# EasyEDA Pro project ProPrj_MPY634乘法器_2025-07-24.epro

# Schematic Schematic1
Board Name: Board1; Create Date: 2025-07-24; Page Name: P1; Project Name: MPY634乘法器; Schematic Name: Schematic1; Update Date: 2025-07-24; Company: 嘉立创EDA; Page Size: A4; Version: V1.0
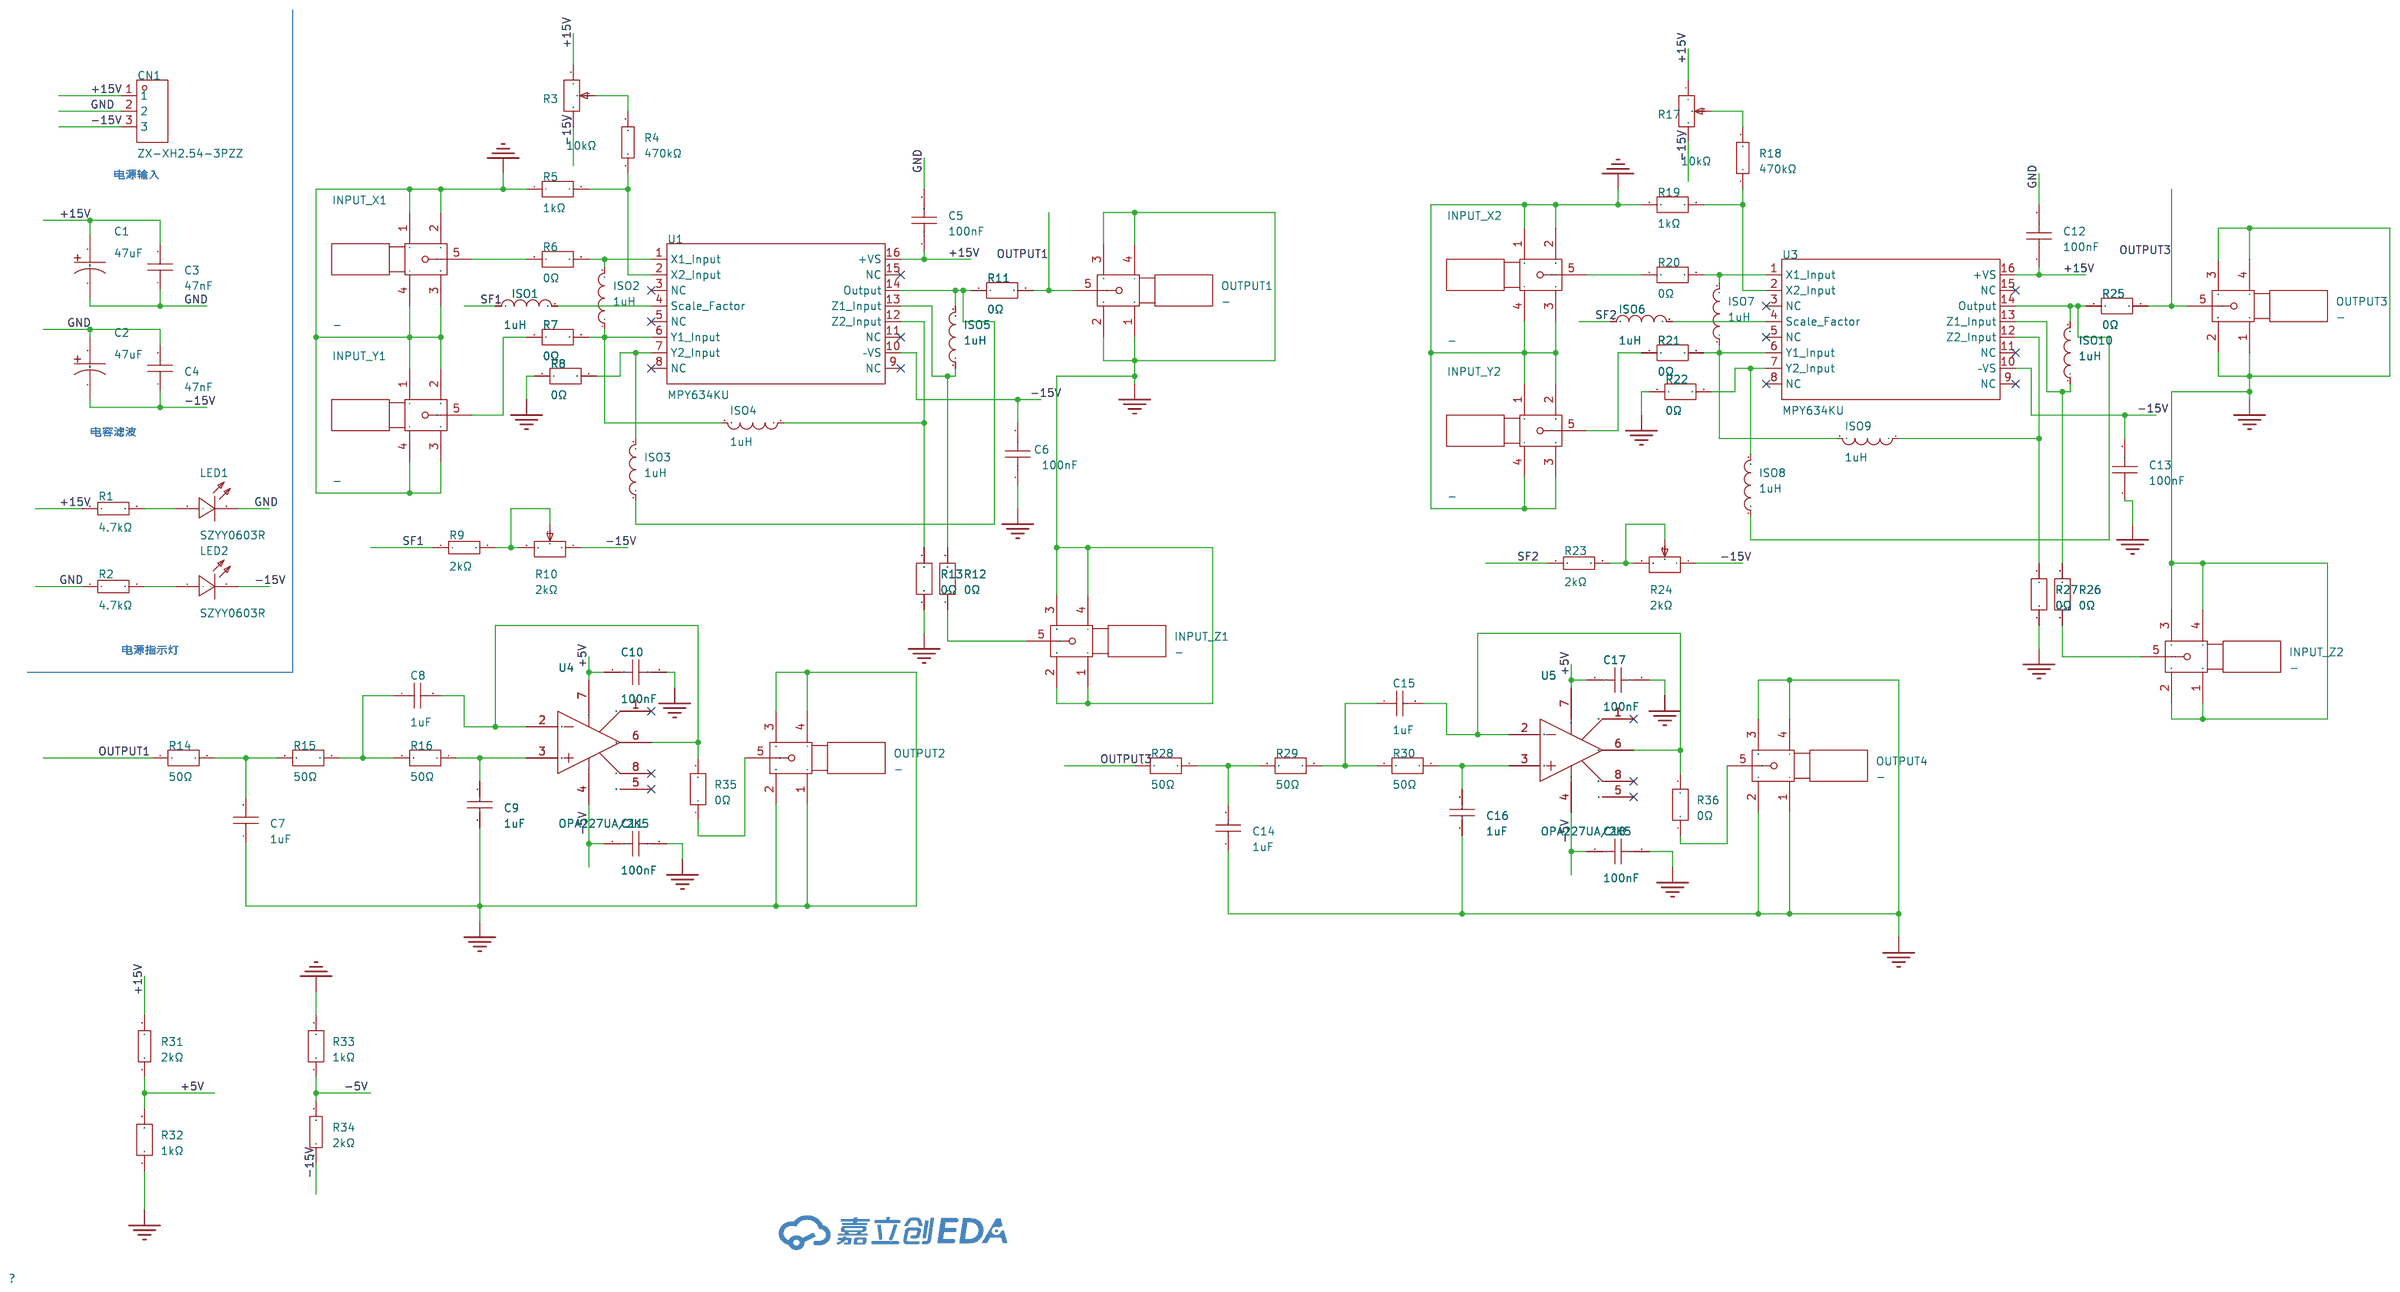
[diagram p0: schematic sheet]

## Parts
C1  47uF  [CAP-TH_BD5.0-P2.00-D0.8-FD]
C2  47uF  [CAP-TH_BD5.0-P2.00-D0.8-FD]
C3  47nF  [C0805]
C4  47nF  [C0805]
C5  100nF  [C0805]
C6  100nF  [C0805]
C7  1uF  [C0805]
C8  1uF  [C0805]
C9  1uF  [C0805]
C10  100nF  [C0805]
C11  100nF  [C0805]
C12  100nF  [C0805]
C13  100nF  [C0805]
C14  1uF  [C0805]
C15  1uF  [C0805]
C16  1uF  [C0805]
C17  100nF  [C0805]
C18  100nF  [C0805]
CN1  ZX-XH2.54-3PZZ  [CONN-TH_3P-P2.54_2501S-3P]
INPUT_X1  -  [SMA-SMD_BWSMA-KE-P001]
INPUT_X2  -  [SMA-SMD_BWSMA-KE-P001]
INPUT_Y1  -  [SMA-SMD_BWSMA-KE-P001]
INPUT_Y2  -  [SMA-SMD_BWSMA-KE-P001]
INPUT_Z1  -  [SMA-SMD_BWSMA-KE-P001]
INPUT_Z2  -  [SMA-SMD_BWSMA-KE-P001]
ISO1  1uH  [IND-SMD_L1.0-W0.6]
ISO2  1uH  [IND-SMD_L1.0-W0.6]
ISO3  1uH  [IND-SMD_L1.0-W0.6]
ISO4  1uH  [IND-SMD_L1.0-W0.6]
ISO5  1uH  [IND-SMD_L1.0-W0.6]
ISO6  1uH  [IND-SMD_L1.0-W0.6]
ISO7  1uH  [IND-SMD_L1.0-W0.6]
ISO8  1uH  [IND-SMD_L1.0-W0.6]
ISO9  1uH  [IND-SMD_L1.0-W0.6]
ISO10  1uH  [IND-SMD_L1.0-W0.6]
LED1  SZYY0603R  [LED0603-R-RD]
LED2  SZYY0603R  [LED0603-R-RD]
OUTPUT1  -  [SMA-SMD_BWSMA-KE-P001]
OUTPUT2  -  [SMA-SMD_BWSMA-KE-P001]
OUTPUT3  -  [SMA-SMD_BWSMA-KE-P001]
OUTPUT4  -  [SMA-SMD_BWSMA-KE-P001]
R1  4.7kΩ  [R0805]
R2  4.7kΩ  [R0805]
R3  10kΩ  [RES-ADJ-TH_3296W]
R4  470kΩ  [R0805]
R5  1kΩ  [R0805]
R6  0Ω  [R0603]
R7  0Ω  [R0603]
R8  0Ω  [R0603]
R9  2kΩ  [R0805]
R10  2kΩ  [RES-ADJ-TH_3296W]
R11  0Ω  [R0603]
R12  0Ω  [R0603]
R13  0Ω  [R0603]
R14  50Ω  [R0805]
R15  50Ω  [R0805]
R16  50Ω  [R0805]
R17  10kΩ  [RES-ADJ-TH_3296W]
R18  470kΩ  [R0805]
R19  1kΩ  [R0805]
R20  0Ω  [R0603]
R21  0Ω  [R0603]
R22  0Ω  [R0603]
R23  2kΩ  [R0805]
R24  2kΩ  [RES-ADJ-TH_3296W]
R25  0Ω  [R0603]
R26  0Ω  [R0603]
R27  0Ω  [R0603]
R28  50Ω  [R0805]
R29  50Ω  [R0805]
R30  50Ω  [R0805]
R31  2kΩ  [R0805]
R32  1kΩ  [R0805]
R33  1kΩ  [R0805]
R34  2kΩ  [R0805]
R35  0Ω  [R0603]
R36  0Ω  [R0603]
U1  MPY634KU  [SOIC-16_L10.3-W7.5-P1.27-LS10.3-BL]
U3  MPY634KU  [SOIC-16_L10.3-W7.5-P1.27-LS10.3-BL]
U4  OPA227UA/2K5  [SOIC-8_L4.9-W3.9-P1.27-LS6.0-BL]
U5  OPA227UA/2K5  [SOIC-8_L4.9-W3.9-P1.27-LS6.0-BL]

## Library data of the parts
C1 C2 = NXB25V47M5*11 2.5TP: 容值:47uF;精度:±20%;额定电压:25V;纹波电流:250mA@100kHz;等效串联电阻(ESR):300mΩ@100kHz;; LCSC Part Name: 47uF ±20% 25V; Supplier Part: C371230; Manufacturer: SAMYOUNG(韩国三莹); Supplier Footprint: 插件,D5xL11mm; JLCPCB Part Class: 扩展库; Datasheet: https://atta.szlcsc.com/upload/public/pdf/source/20190227/C371244_FA85FFEFC2961227CF12E3CCE8C34A7D.pdf; Supplier: LCSC; Tolerance: ±20%; Voltage Rating: 25V; Ripple Current: 250mA@100kHz; Equivalent Series Resistance(ESR): 300mΩ@100kHz; Pin Spacing: 2mm; Diameter: 5mm; Height - Seated (Max): 11mm; Lifetime: 2000hrs@105℃; Operating Temperature: -40℃~+105℃
C3 C4 = CL21B473KBCNNNC: 容值:47nF;精度:±10%;额定电压:50V;材质(温度系数):X7R;; LCSC Part Name: 47nF ±10% 50V; Supplier Part: C53134; Manufacturer: SAMSUNG(三星); Supplier Footprint: 0805; JLCPCB Part Class: 基础库; Datasheet: https://atta.szlcsc.com/upload/public/pdf/source/20160218/1457707763339.pdf; Supplier: LCSC; Tolerance: ±10%; Voltage Rated: 50V; Temperature Coefficient: X7R
C5 C6 C10-C13 C17 C18 = CC0805KRX7R9BB104: 容值:100nF;精度:±10%;额定电压:50V;材质(温度系数):X7R;; LCSC Part Name: 100nF ±10% 50V; Supplier Part: C49678; Manufacturer: YAGEO(国巨); Supplier Footprint: 0805; JLCPCB Part Class: 基础库; Datasheet: https://atta.szlcsc.com/upload/public/pdf/source/20180224/C181747_15194369449651363981.pdf; Supplier: LCSC; Tolerance: ±10%; Voltage Rated: 50V; Temperature Coefficient: X7R
C7-C9 C14-C16 = CL21B105KBFNNNE: 容值:1uF;精度:±10%;额定电压:50V;材质(温度系数):X7R;; LCSC Part Name: 1uF ±10% 50V; Supplier Part: C28323; Manufacturer: SAMSUNG(三星); Supplier Footprint: 0805; JLCPCB Part Class: 基础库; Datasheet: https://atta.szlcsc.com/upload/public/pdf/source/20160218/1457707763339.pdf; Supplier: LCSC; Tolerance: ±10%; Voltage Rated: 50V; Temperature Coefficient: X7R
CN1 = ZX-XH2.54-3PZZ: 插针结构:1x3P;间距:2.5mm;安装方式:直插;参考系列:XH;总PIN数:3P;排数:1;每排PIN数:3;行距:-;额定电流:3A;触头材质:黄铜;触头镀层:锡;工作温度范围:-25℃~+85℃;; LCSC Part Name: 1x3P 间距:2.5mm 直插 系列:XH; Supplier Part: C7429633; Manufacturer: Megastar(兆星); Supplier Footprint: 插件,P=2.5mm; JLCPCB Part Class: 扩展库; Datasheet: https://atta.szlcsc.com/upload/public/pdf/source/20230619/AE17037A2CFDBE8D9CBA775D61AD0A84.pdf; Supplier: LCSC; Pins Structure: 1x3P; Pitch: 2.5mm; Mounting Type: 直插; Reference Series: XH; Number of Pins: 3P; Number of Rows: 1; Number of PINs Per Row: 3; Rated Current: 3A; Contact Material: 黄铜; Contact Plating: 锡; Operating Temperature: -25℃~+85℃; Rated Voltage (Max): 250V; Plastic Material: PA66; Flame Retardant Rating: UL94V-0; Color: 白色; Z-Height of the Board: 7mm; X-Length of Bottom Edge on Board (Spacing Line): 10mm; Y-Width of Bottom Edge on Board: 5.9mm
INPUT_X1 INPUT_X2 INPUT_Y1 INPUT_Y2 INPUT_Z1 INPUT_Z2 OUTPUT1-OUTPUT4 = BWSMA-KE-P001: 连接器类型:板端;接口类型:内孔;端口数量:1;接口直径:5.2mm;接口长度/高度:-;频率:-;射频系列:SMA;阻抗:50Ω;样式:偏脚;工作温度:-;; LCSC Part Name: 内孔 SMA 偏脚; Supplier Part: C496550; Manufacturer: BAT WIRELESS(蝙蝠无线); Supplier Footprint: SMD; JLCPCB Part Class: 扩展库; Datasheet: https://atta.szlcsc.com/upload/public/pdf/source/20240320/28FD502871C976DFF213ABFCF2A0ED51.pdf; Supplier: LCSC; Connector Type: 板端; Interface: 内孔; Number of Ports: 1; Interface Diameter: 5.2mm; RF Series: SMA; Impedance: 50Ω; Style: 偏脚
ISO1-ISO10 = LQW15CN1R0M10D: 电感值:1uH;精度:±20%;额定电流:270mA;饱和电流(Isat):-;; LCSC Part Name: 1uH ±20%; Supplier Part: C703068; Manufacturer: muRata(村田); Supplier Footprint: 0402; JLCPCB Part Class: 扩展库; Datasheet: https://atta.szlcsc.com/upload/public/pdf/source/20191022/C440248_094C93E028FCF0FA66FA57BC1ADCD3EF.pdf; Supplier: LCSC; Tolerance: ±20%; Rated Current: 270mA; DC Resistance (DCR): 940mΩ
LED1 LED2 = SZYY0603R: 发光颜色:红色;功率:40mW;正向电流:20mA;主波长:615nm~630nm;二极管配置:-;透镜颜色:无色透明透镜;色温:-;发光角度:120°;载带方式:-;工作温度:-40℃~+85℃;; LCSC Part Name: 红灯; Supplier Part: C434419; Manufacturer: yongyu(永裕光电); Supplier Footprint: 0603; JLCPCB Part Class: 扩展库; Datasheet: https://atta.szlcsc.com/upload/public/pdf/source/20191204/C434419_0B955C1F73FF88449D9A795B6FF49070.pdf; Supplier: LCSC; Emitted Color: 红色; Power Dissipation: 40mW; Forward Current: 20mA; Dominant Wavelength: 615nm~630nm; Peak Wavelength: 645nm; Lens Color: 无色透明透镜; Viewing Angle: 120°; Operating Temperature: -40℃~+85℃
R1 R2 = 0805W8F4701T5E: 电阻类型:厚膜电阻;阻值:4.7kΩ;精度:±1%;功率:125mW;最大工作电压:150V;温度系数:±100ppm/℃;; LCSC Part Name: 4.7kΩ ±1% 125mW 厚膜电阻; Supplier Part: C17673; Manufacturer: UNI-ROYAL(厚声); Supplier Footprint: 0805; JLCPCB Part Class: 基础库; Datasheet: https://atta.szlcsc.com/upload/public/pdf/source/20200306/C422600_1E6D84923E4A46A82E41ADD87F860B5C.pdf; Supplier: LCSC; Type: 厚膜电阻; Tolerance: ±1%; Power(Watts): 125mW; Overload Voltage (Max): 150V; Temperature Coefficient: ±100ppm/℃; Operating Temperature Range: -55℃~+155℃
R3 R17 = 3296W-1-103LF: 阻值:10kΩ;精度:±10%;功率:500mW;温度系数:±100ppm/℃;; LCSC Part Name: 10kΩ ±10%; Supplier Part: C34846; Manufacturer: BOURNS; Supplier Footprint: SIP-3P,9.5x4.8mm; JLCPCB Part Class: 扩展库; Datasheet: https://atta.szlcsc.com/upload/public/pdf/source/20151026/1457707506403.pdf; Supplier: LCSC; Tolerance: ±10%; Power(Watts): 500mW; Temperature Coefficient: ±100ppm/℃; Turns: 25
R4 R18 = 0805W8F4703T5E: 电阻类型:厚膜电阻;阻值:470kΩ;精度:±1%;功率:125mW;最大工作电压:150V;温度系数:±100ppm/℃;; LCSC Part Name: 470kΩ ±1% 125mW 厚膜电阻; Supplier Part: C17709; Manufacturer: UNI-ROYAL(厚声); Supplier Footprint: 0805; JLCPCB Part Class: 基础库; Datasheet: https://atta.szlcsc.com/upload/public/pdf/source/20200306/C422600_1E6D84923E4A46A82E41ADD87F860B5C.pdf; Supplier: LCSC; Type: 厚膜电阻; Tolerance: ±1%; Power(Watts): 125mW; Overload Voltage (Max): 150V; Temperature Coefficient: ±100ppm/℃; Operating Temperature Range: -55℃~+155℃
R5 R19 R32 R33 = FRC0805J102 TS: 电阻类型:厚膜电阻;阻值:1kΩ;精度:±5%;功率:125mW;最大工作电压:150V;温度系数:±100ppm/℃;; LCSC Part Name: 1kΩ ±5% 125mW 厚膜电阻; Supplier Part: C2907295; Manufacturer: FOJAN(富捷); Supplier Footprint: 0805; JLCPCB Part Class: 扩展库; Datasheet: https://atta.szlcsc.com/upload/public/pdf/source/20211221/925EC7D7225764EE0046F22065062C87.pdf; Supplier: LCSC; Type: 厚膜电阻; Tolerance: ±5%; Power(Watts): 125mW; Overload Voltage (Max): 150V; Temperature Coefficient: ±100ppm/℃; Operating Temperature Range: -55℃~+155℃
R6-R8 R11-R13 R20-R22 R25-R27 R35 R36 = FRC0603P000 TS: 电阻类型:厚膜电阻;阻值:0Ω;精度:±5%;功率:100mW;最大工作电压:75V;; LCSC Part Name: 0Ω ±5% 100mW 厚膜电阻; Supplier Part: C2907080; Manufacturer: FOJAN(富捷); Supplier Footprint: 0603; JLCPCB Part Class: 扩展库; Datasheet: https://atta.szlcsc.com/upload/public/pdf/source/20211221/925EC7D7225764EE0046F22065062C87.pdf; Supplier: LCSC; Type: 厚膜电阻; Tolerance: ±5%; Power(Watts): 100mW; Overload Voltage (Max): 75V; Operating Temperature Range: -55℃~+155℃
R9 R23 R31 R34 = 0805W8F2001T5E: 电阻类型:厚膜电阻;阻值:2kΩ;精度:±1%;功率:125mW;最大工作电压:150V;温度系数:±100ppm/℃;; LCSC Part Name: 2kΩ ±1% 125mW 厚膜电阻; Supplier Part: C17604; Manufacturer: UNI-ROYAL(厚声); Supplier Footprint: 0805; JLCPCB Part Class: 基础库; Datasheet: https://atta.szlcsc.com/upload/public/pdf/source/20200306/C422600_1E6D84923E4A46A82E41ADD87F860B5C.pdf; Supplier: LCSC; Type: 厚膜电阻; Tolerance: ±1%; Power(Watts): 125mW; Overload Voltage (Max): 150V; Temperature Coefficient: ±100ppm/℃; Operating Temperature Range: -55℃~+155℃
R10 R24 = 3296W-1-202LF: 阻值:2kΩ;精度:±10%;; LCSC Part Name: 2kΩ ±10%; Supplier Part: C83684; Manufacturer: BOURNS; Supplier Footprint: SIP-3P,9.5x4.8mm; JLCPCB Part Class: 扩展库; Datasheet: https://atta.szlcsc.com/upload/public/pdf/source/20180326/C111793_7BE3639881F18EA7BF3D269EDA80A489.pdf; Supplier: LCSC; Tolerance: ±10%
R14-R16 R28-R30 = TD05G50R0BT: 电阻类型:薄膜电阻;阻值:50Ω;精度:±0.1%;功率:100mW;温度系数:±25ppm/℃;; LCSC Part Name: 薄膜电阻 50Ω ±0.1% 100mW; Supplier Part: C5355206; Manufacturer: FH(风华); Supplier Footprint: 0805; JLCPCB Part Class: 扩展库; Datasheet: https://atta.szlcsc.com/upload/public/pdf/source/20220726/97950D08E3EA8CC4F1F63A0C564F66E4.pdf; Supplier: LCSC; Type: 薄膜电阻; Tolerance: ±0.1%; Power(Watts): 100mW; Temperature Coefficient: ±25ppm/℃
U1 U3 = MPY634KU: 象限:四象限;带宽:-;; Supplier Part: C2867515; Manufacturer: TI(德州仪器); Supplier Footprint: SOIC-16-300mil; JLCPCB Part Class: 扩展库; Datasheet: https://www.ti.com/cn/lit/gpn/mpy634; Supplier: LCSC; Quadrant: 四象限
U4 U5 = OPA227UA/2K5: 放大器数:单路;增益带宽积(GBP):8MHz;输入偏置电流(Ib):2.5nA;压摆率(SR):2.3V/us;轨到轨:-;; Supplier Part: C456278; Manufacturer: TI(德州仪器); Supplier Footprint: SOIC-8; JLCPCB Part Class: 扩展库; Datasheet: https://www.ti.com/cn/lit/gpn/opa227; Supplier: LCSC; Number of Channels: 单路; Gain Bandwidth Product: 8MHz; Ib - Input Bias Current: 2.5nA; Slew Rate: 2.3V/us; Output Current: 45mA; Operating Temperature: -40℃~+85℃

## Nets
+5V: C10.1 C17.1 R31.1 R32.2 U4.7(VCC) U5.7(VCC)
+15V: C1.1 C3.2 C5.1 C12.1 CN1.1 R1.1 R3.1 R17.1 R31.2 U1.16(+VS) U3.16(+VS)
-5V: C11.1 C18.1 R33.1 R34.2 U4.4(VSS) U5.4(VSS)
-15V: C2.2 C4.1 C6.2 C13.2 CN1.3 LED2.2(-) R3.3 R10.1 R17.3 R24.1 R34.1 U1.10(–VS) U3.10(–VS)
GND: C1.2 C2.1 C3.1 C4.2 C5.2 C6.1 C7.1 C9.1 C10.2 C11.2 C12.2 C13.1 C14.1 C16.1 C17.2 C18.2 CN1.2 INPUT_X1.1 INPUT_X1.2 INPUT_X1.3 INPUT_X1.4 INPUT_X2.1 INPUT_X2.2 INPUT_X2.3 INPUT_X2.4 INPUT_Y1.1 INPUT_Y1.2 INPUT_Y1.3 INPUT_Y1.4 INPUT_Y2.1 INPUT_Y2.2 INPUT_Y2.3 INPUT_Y2.4 INPUT_Z1.1 INPUT_Z1.2 INPUT_Z1.3 INPUT_Z1.4 INPUT_Z2.1 INPUT_Z2.2 INPUT_Z2.3 INPUT_Z2.4 LED1.2(-) OUTPUT1.1 OUTPUT1.2 OUTPUT1.3 OUTPUT1.4 OUTPUT2.1 OUTPUT2.2 OUTPUT2.3 OUTPUT2.4 OUTPUT3.1 OUTPUT3.2 OUTPUT3.3 OUTPUT3.4 OUTPUT4.1 OUTPUT4.2 OUTPUT4.3 OUTPUT4.4 R2.1 R5.1 R8.1 R13.2 R19.1 R22.1 R27.2 R32.1 R33.2
OUTPUT1: OUTPUT1.5 R11.2 R14.1
OUTPUT3: OUTPUT3.5 R25.2 R28.1
SF1: ISO1.1 R9.1
SF2: ISO6.1 R23.1
$1N691: LED2.1(+) R2.2
$1N692: LED1.1(+) R1.2
$1N1030: INPUT_X1.5 R6.1
$1N1329: R3.2 R4.2
$1N1619: INPUT_Y1.5 R7.1
$1N1823: R9.2 R10.2 R10.3
$1N2332: INPUT_Z1.5 R12.1
$1N3642: INPUT_X2.5 R20.1
$1N3650: R17.2 R18.2
$1N3683: INPUT_Y2.5 R21.1
$1N3702: R23.2 R24.2 R24.3
$1N3758: INPUT_Z2.5 R26.1
$1N4258: C7.2 R14.2 R15.2
$1N4259: C8.1 R15.1 R16.2
$1N4690: C14.2 R28.2 R29.2
$1N4691: C15.1 R29.1 R30.2
$1N5450: OUTPUT2.5 R35.1
$1N5538: OUTPUT4.5 R36.1
Net-(C8-2): C8.2 R35.2 U4.2(VIN-) U4.6(OUT)
Net-(C9-2): C9.2 R16.1 U4.3(VIN+)
Net-(C15-2): C15.2 R36.2 U5.2(VIN-) U5.6(OUT)
Net-(C16-2): C16.2 R30.1 U5.3(VIN+)
Net-(ISO1-2): ISO1.2 U1.4(Scale Factor)
Net-(ISO2-1): ISO2.1 ISO4.2 R7.2 U1.6(Y1 Input)
Net-(ISO2-2): ISO2.2 R6.2 U1.1(X1 Input)
Net-(ISO3-1): ISO3.1 ISO5.2 R11.1 U1.14(Output)
Net-(ISO3-2): ISO3.2 R8.2 U1.7(Y2 Input)
Net-(ISO4-1): ISO4.1 R13.1 U1.12(Z2 Input)
Net-(ISO5-1): ISO5.1 R12.2 U1.13(Z1 Input)
Net-(ISO6-2): ISO6.2 U3.4(Scale Factor)
Net-(ISO7-1): ISO7.1 ISO9.2 R21.2 U3.6(Y1 Input)
Net-(ISO7-2): ISO7.2 R20.2 U3.1(X1 Input)
Net-(ISO8-1): ISO8.1 ISO10.2 R25.1 U3.14(Output)
Net-(ISO8-2): ISO8.2 R22.2 U3.7(Y2 Input)
Net-(ISO9-1): ISO9.1 R27.1 U3.12(Z2 Input)
Net-(ISO10-1): ISO10.1 R26.2 U3.13(Z1 Input)
Net-(R4-1): R4.1 R5.2 U1.2(X2 Input)
Net-(R18-1): R18.1 R19.2 U3.2(X2 Input)

Not connected (* = marked no-connect by the designer): U1 3(NC)* 5(NC)* 8(NC)* 9(NC)* 11(NC)* 15(NC)*; U3 3(NC)* 5(NC)* 8(NC)* 9(NC)* 11(NC)* 15(NC)*; U4 1(TRIM)* 5(NC)* 8(TRIM)*; U5 1(TRIM)* 5(NC)* 8(TRIM)*

## Notes on the sheet
- 电源输入
- 电容滤波
- 电源指示灯

# Board PCB1
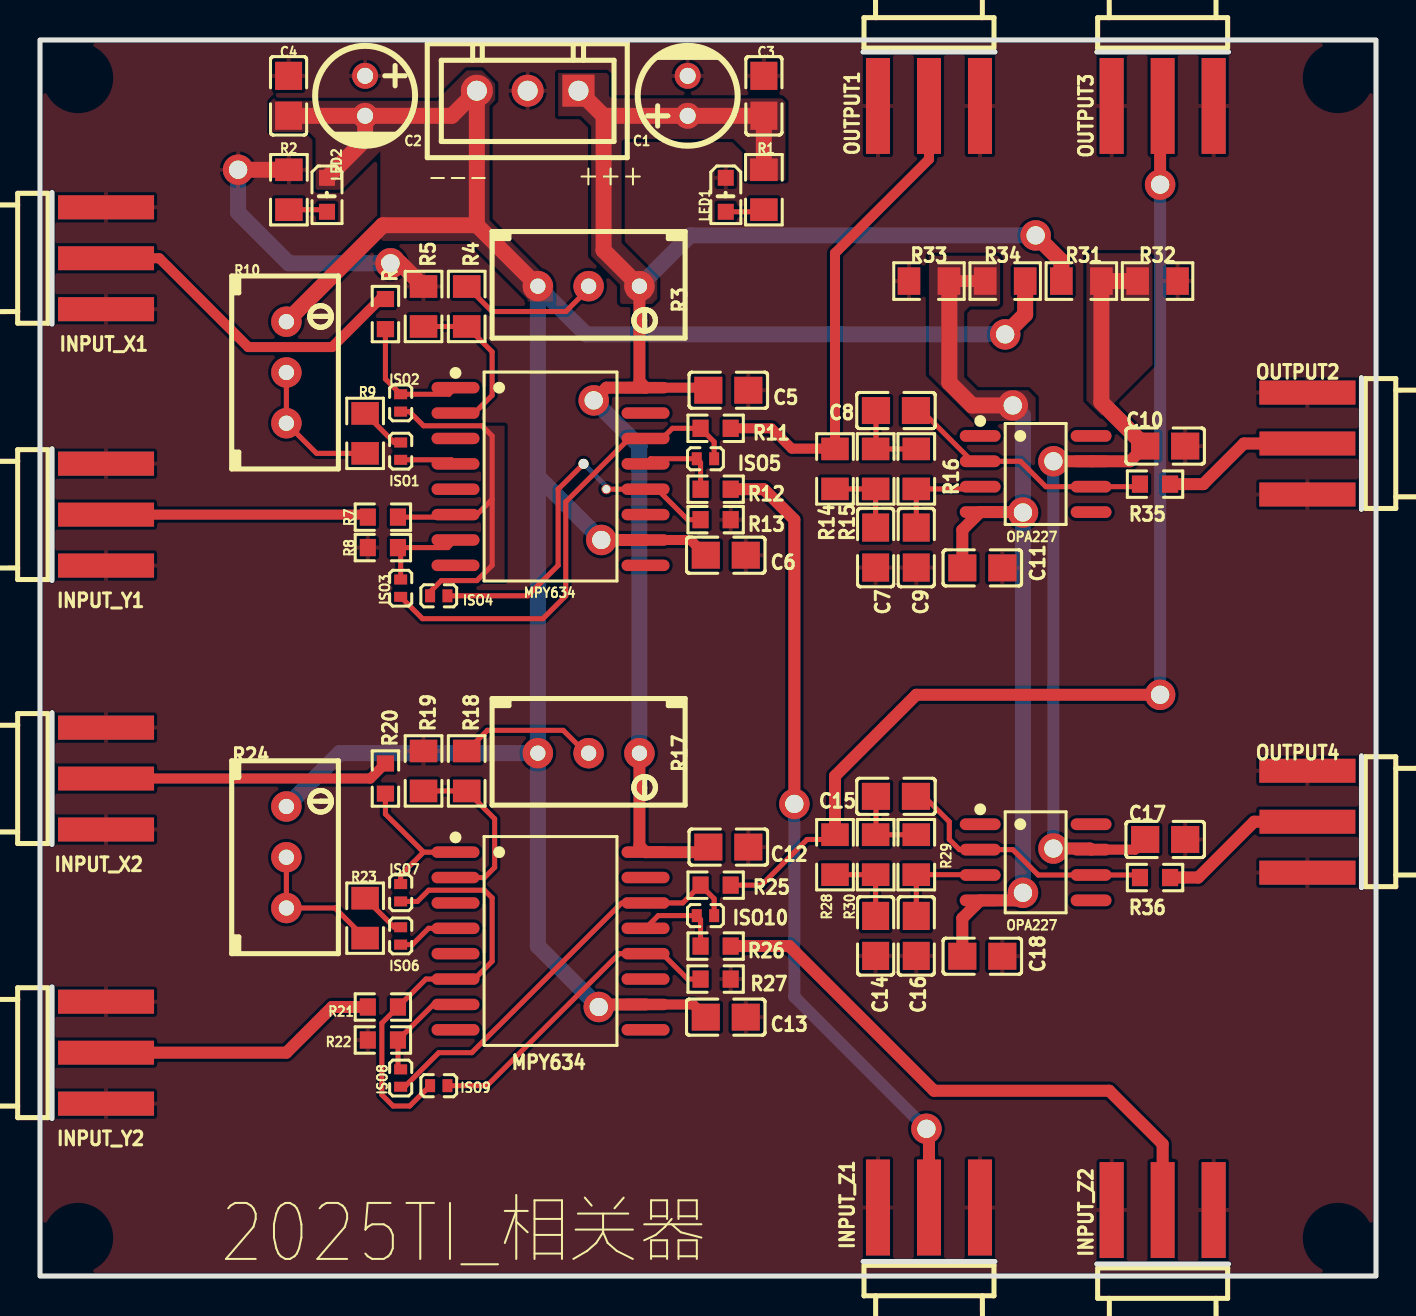
[diagram p1: board, top side]
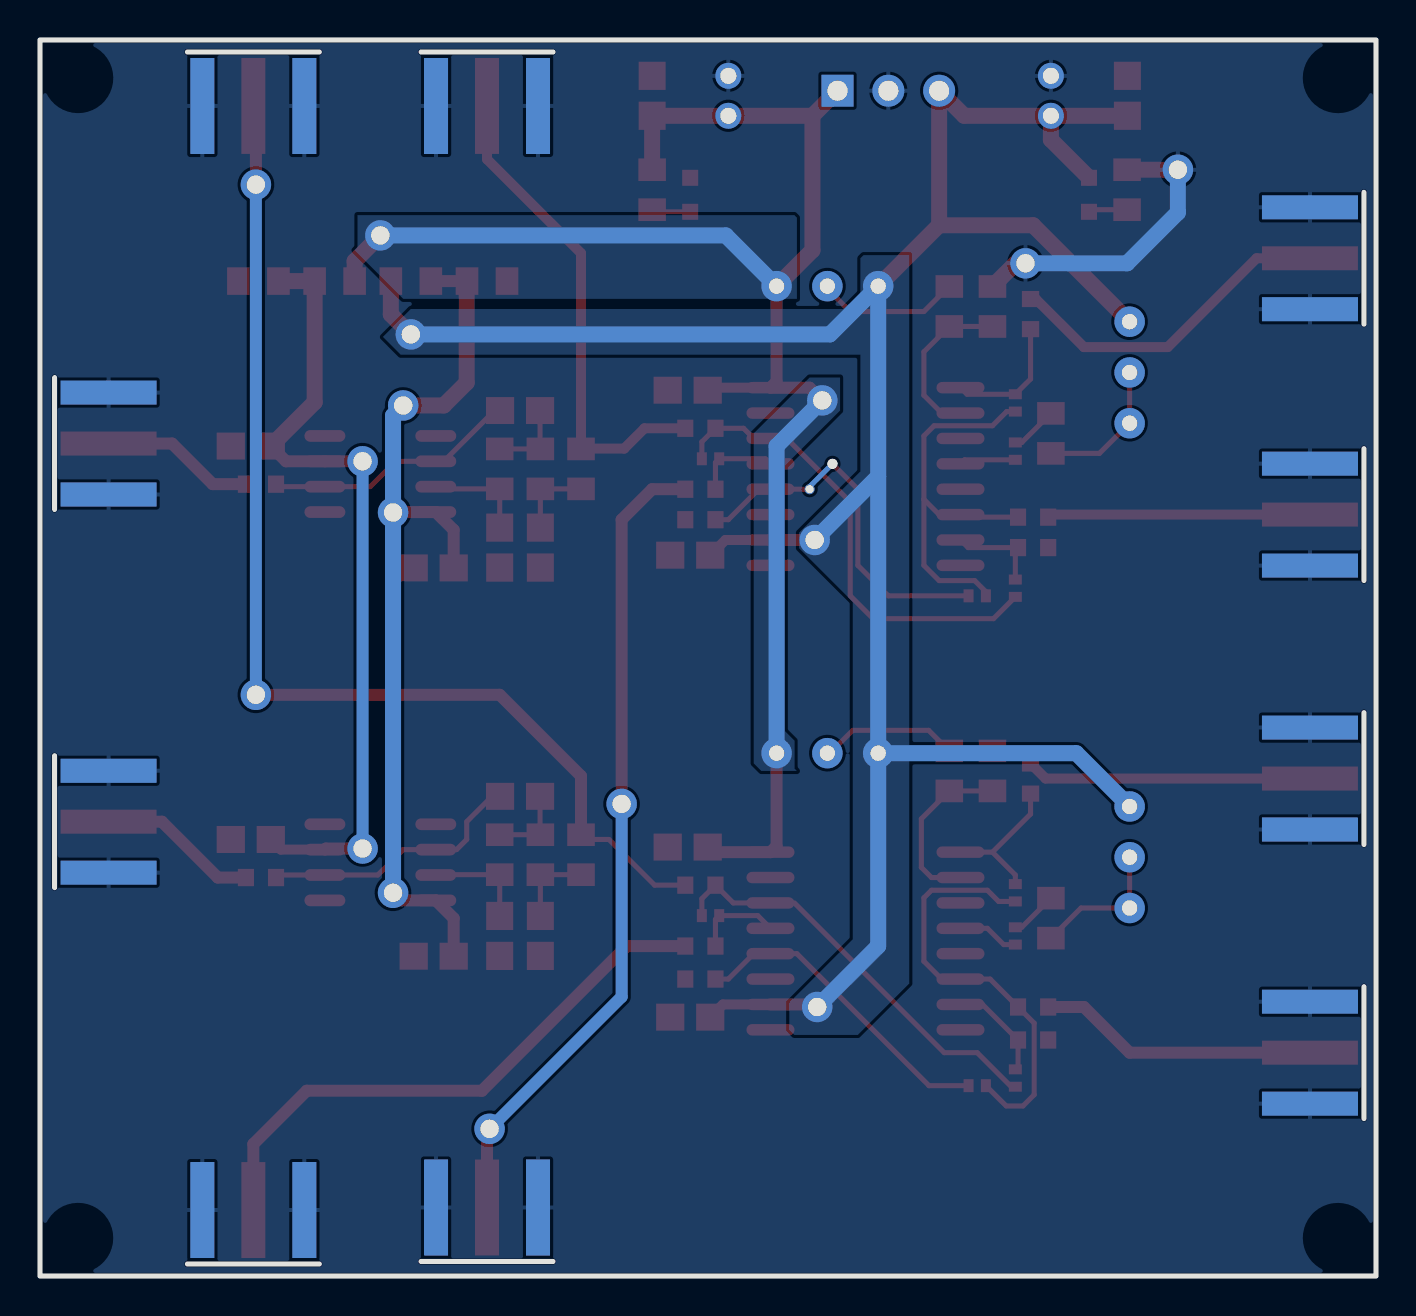
[diagram p2: board, bottom side, seen from below]

Outline 66.8 x 61.85 mm; copper layers: Top Layer, Bottom Layer. Coordinates in mm from the lower left corner of the outline.
Outline path: rectangle 0,61.85 66.8,0
Stack: Top Layer 0.035mm / Dielectric1 1.51mm FR4 er 4.5 / Bottom Layer 0.035mm

## Design rules (mm)
template: JLCPCB Capability(Two Layers Board)
spacing copperThickness1oz (default): track to track 0.102, other pairs 0.152 to 0.3
spacing copperThickness2oz: track to track 0.203, other pairs 0.152 to 0.3
track width copperThickness1oz (default): min 0.127, default 0.254, max 2.54
track width copperThickness2oz: min 0.203, default 0.254, max 2.54
differential pair differentialPair (default): width min 0.127, default 0.254, max 2.54; gap min 0.152, default 0.152
via viaSize (default): diameter min 0.5, default 0.61, max 10; hole min 0.3, default 0.305, max 6.3

## Placement (name value [footprint] x y rotation side)
---  ZX-XH2.54-3PZZ  [CONN-TH_3P-P2.54_2501S-3P]  24.38 59.31 180 top
C1  47uF  [CAP-TH_BD5.0-P2.00-D0.8-FD]  32.39 59.05 90 top
C2  47uF  [CAP-TH_BD5.0-P2.00-D0.8-FD]  16.26 59.05 270 top
C3  47nF  [C0805]  36.2 59.05 270 top
C4  47nF  [C0805]  12.43 59.05 90 top
C5  100nF  [C0805]  34.42 44.32 0 top
C6  100nF  [C0805]  34.29 36.07 180 top
C7  1uF  [C0805]  41.78 36.45 90 top
C8  1uF  [C0805]  42.8 43.31 0 top
C9  1uF  [C0805]  43.82 36.45 90 top
C10  100nF  [C0805]  56.26 41.53 0 top
C11  100nF  [C0805]  47.12 35.43 0 top
C12  100nF  [C0805]  34.42 21.46 0 top
C13  100nF  [C0805]  34.29 12.95 180 top
C14  1uF  [C0805]  41.78 17.02 90 top
C15  1uF  [C0805]  42.8 24 0 top
C16  1uF  [C0805]  43.82 17.02 90 top
C17  100nF  [C0805]  56.26 21.84 0 top
C18  100nF  [C0805]  47.12 16 0 top
INPUT_X1  -  [SMA-SMD_BWSMA-KE-P001]  3.3 50.93 180 top
INPUT_X2  -  [SMA-SMD_BWSMA-KE-P001]  3.3 24.89 180 top
INPUT_Y1  -  [SMA-SMD_BWSMA-KE-P001]  3.3 38.1 180 top
INPUT_Y2  -  [SMA-SMD_BWSMA-KE-P001]  3.3 11.18 180 top
INPUT_Z1  -  [SMA-SMD_BWSMA-KE-P001]  44.45 3.43 270 top
INPUT_Z2  -  [SMA-SMD_BWSMA-KE-P001]  56.13 3.3 270 top
ISO1  1uH  [IND-SMD_L1.0-W0.6]  18.03 41.27 270 top
ISO2  1uH  [IND-SMD_L1.0-W0.6]  18.03 43.69 90 top
ISO3  1uH  [IND-SMD_L1.0-W0.6]  18.03 34.42 90 top
ISO4  1uH  [IND-SMD_L1.0-W0.6]  19.94 34.04 180 top
ISO5  1uH  [IND-SMD_L1.0-W0.6]  33.27 40.89 0 top
ISO6  1uH  [IND-SMD_L1.0-W0.6]  18.03 17.02 270 top
ISO7  1uH  [IND-SMD_L1.0-W0.6]  18.03 19.18 90 top
ISO8  1uH  [IND-SMD_L1.0-W0.6]  18.03 9.91 90 top
ISO9  1uH  [IND-SMD_L1.0-W0.6]  19.94 9.52 180 top
ISO10  1uH  [IND-SMD_L1.0-W0.6]  33.27 18.03 0 top
LED1  SZYY0603R  [LED0603-R-RD]  34.29 54.1 270 top
LED2  SZYY0603R  [LED0603-R-RD]  14.35 54.1 270 top
MPY634  -  [SOIC-16_L10.3-W7.5-P1.27-LS10.3-BL]  25.53 16.76 270 top
MPY634#2  -  [SOIC-16_L10.3-W7.5-P1.27-LS10.3-BL]  25.53 40 270 top
NOREF  -  [Pad_e906]  28.32 39.37 0 top
NOREF#2  -  [Pad_e1168]  17.53 50.67 0 top
NOREF#3  -  [Pad_e330]  49.78 52.07 0 top
NOREF#4  -  [Pad_e407]  44.32 7.37 0 top
NOREF#5  -  [Pad_e351]  49.15 19.18 0 top
NOREF#6  -  [Pad_e417]  56.01 54.61 0 top
NOREF#7  -  [Pad_e361]  50.67 40.77 0 top
NOREF#8  -  [Pad_e387]  27.94 13.46 0 top
NOREF#9  -  [Pad_e348]  49.15 38.21 0 top
NOREF#10  -  [Pad_e342]  48.64 43.56 0 top
NOREF#11  -  [Pad_e391]  27.69 43.81 0 top
NOREF#12  -  [Pad_e404]  37.72 23.62 0 top
NOREF#13  -  [Pad_e364]  50.67 21.39 0 top
NOREF#14  -  [Pad_e381]  28.07 36.83 0 top
NOREF#15  -  [Pad_e329]  48.26 47.12 0 top
NOREF#16  -  [Pad_e415]  56.01 29.08 0 top
NOREF#17  -  [Pad_e1164]  9.91 55.36 0 top
NOREF#18  -  [Pad_e903]  27.18 40.64 0 top
OPA227  -  [SOIC-8_L4.9-W3.9-P1.27-LS6.0-BL]  49.78 20.7 270 top
OPA227#2  -  [SOIC-8_L4.9-W3.9-P1.27-LS6.0-BL]  49.78 40.13 270 top
OUTPUT1  -  [SMA-SMD_BWSMA-KE-P001]  44.45 58.55 90 top
OUTPUT2  -  [SMA-SMD_BWSMA-KE-P001]  63.37 41.66 0 top
OUTPUT3  -  [SMA-SMD_BWSMA-KE-P001]  56.13 58.55 90 top
OUTPUT4  -  [SMA-SMD_BWSMA-KE-P001]  63.37 22.73 0 top
R1  4.7kΩ  [R0805]  36.2 54.36 270 top
R2  4.7kΩ  [R0805]  12.45 54.36 270 top
R3  10kΩ  [RES-ADJ-TH_3296W]  27.43 49.53 270 top
R4  470kΩ  [R0805]  21.34 48.51 90 top
R5  1kΩ  [R0805]  19.18 48.51 270 top
R6  0Ω  [R0603]  17.27 48.13 270 top
R7  0Ω  [R0603]  17.14 37.97 0 top
R8  0Ω  [R0603]  17.14 36.45 0 top
R9  2kΩ  [R0805]  16.26 42.16 270 top
R10  2kΩ  [RES-ADJ-TH_3296W]  12.32 45.21 0 top
R11  0Ω  [R0603]  33.78 42.42 0 top
R12  0Ω  [R0603]  33.78 39.37 180 top
R13  0Ω  [R0603]  33.78 37.85 0 top
R14  50Ω  [R0805]  39.75 40.39 270 top
R15  50Ω  [R0805]  41.78 40.39 270 top
R16  50Ω  [R0805]  43.82 40.39 90 top
R17  10kΩ  [RES-ADJ-TH_3296W]  27.43 26.16 270 top
R18  470kΩ  [R0805]  21.34 25.27 90 top
R19  1kΩ  [R0805]  19.18 25.27 270 top
R20  0Ω  [R0603]  17.27 24.89 270 top
R21  0Ω  [R0603]  17.14 13.46 0 top
R22  0Ω  [R0603]  17.14 11.81 0 top
R23  2kΩ  [R0805]  16.26 17.91 270 top
R24  2kΩ  [RES-ADJ-TH_3296W]  12.32 20.95 0 top
R25  0Ω  [R0603]  33.78 19.56 0 top
R26  0Ω  [R0603]  33.78 16.51 180 top
R27  0Ω  [R0603]  33.78 14.86 0 top
R28  50Ω  [R0805]  39.75 21.08 270 top
R29  50Ω  [R0805]  41.78 21.08 270 top
R30  50Ω  [R0805]  43.82 21.08 90 top
R31  2kΩ  [R0805]  52.07 49.78 180 top
R32  1kΩ  [R0805]  55.88 49.78 180 top
R33  1kΩ  [R0805]  44.45 49.78 180 top
R34  2kΩ  [R0805]  48.26 49.78 180 top
R35  0Ω  [R0603]  55.75 39.62 180 top
R36  0Ω  [R0603]  55.75 19.94 180 top

## Footprints (pads in the part's own frame, mm; a bottom-side part is the same pattern mirrored in y, then rotated)
C0805
  rect 1.41x1.35 smd: 1(-1,0) 2(1,0)
CAP-TH_BD5.0-P2.00-D0.8-FD
  round 1.3 hole 0.8: 1(-1,0) 2(1,0)
CONN-TH_3P-P2.54_2501S-3P
  rect 1.6x1.6 hole 1: 1(-2.54,0)
  round 1.6 hole 1: 2(0,0) 3(2.54,0)
IND-SMD_L1.0-W0.6
  rect 0.5x0.648 smd: 1(-0.434,0) 2(0.434,0)
LED0603-R-RD
  rect 0.8x0.8 smd: 1(0.851,0) 2(-0.851,0)
Pad_e329
  round 1.524 hole 0.914: 1(0,0)
Pad_e330
  round 1.524 hole 0.914: 2(0,0)
Pad_e342
  round 1.524 hole 0.914: 1(0,0)
Pad_e348
  round 1.524 hole 0.914: 1(0,0)
Pad_e351
  round 1.524 hole 0.914: 1(0,0)
Pad_e361
  round 1.524 hole 0.914: 1(0,0)
Pad_e364
  round 1.524 hole 0.914: 1(0,0)
Pad_e381
  round 1.524 hole 0.914: 1(0,0)
Pad_e387
  round 1.524 hole 0.914: 1(0,0)
Pad_e391
  round 1.524 hole 0.914: 1(0,0)
Pad_e404
  round 1.524 hole 0.914: 1(0,0)
Pad_e407
  round 1.524 hole 0.914: 1(0,0)
Pad_e415
  round 1.524 hole 0.914: 1(0,0)
Pad_e417
  round 1.524 hole 0.914: 2(0,0)
Pad_e903
  round 0.5 hole 0.914x0.4: 1(0,0)
Pad_e906
  round 0.5 hole 0.4: 1(0,0)
Pad_e1164
  round 1.524 hole 0.914: 1(0,0)
Pad_e1168
  round 1.524 hole 0.914: 1(0,0)
R0603
  rect 0.806x0.864 smd: 1(-0.753,0) 2(0.753,0)
R0805
  rect 1.133x1.377 smd: 1(-1,0) 2(1,0)
RES-ADJ-TH_3296W
  round 1.524 hole 0.762: 1(0,2.54) 2(0,0) 3(0,-2.54)
SMA-SMD_BWSMA-KE-P001
  rect 4.8x1.2 smd: 1(0,-2.55) 2(0,2.55) 5(0,0)
  rect 4.8x1.2 smd far side: 3(0,2.55) 4(0,-2.55)
SOIC-8_L4.9-W3.9-P1.27-LS6.0-BL
  oval 0.588x2.045 smd: 1(-1.905,-2.772) 2(-0.635,-2.772) 3(0.635,-2.772) 4(1.905,-2.772) 5(1.905,2.772) 6(0.635,2.772) 7(-0.635,2.772) 8(-1.905,2.772)
SOIC-16_L10.3-W7.5-P1.27-LS10.3-BL
  oval 0.574x2.401 smd: 1(-4.445,-4.75) 2(-3.175,-4.75) 3(-1.905,-4.75) 4(-0.635,-4.75) 5(0.635,-4.75) 6(1.905,-4.75) 7(3.175,-4.75) 8(4.445,-4.75) 9(4.445,4.75) 10(3.175,4.75) 11(1.905,4.75) 12(0.635,4.75) 13(-0.635,4.75) 14(-1.905,4.75) 15(-3.175,4.75) 16(-4.445,4.75)

## Nets
+5V: C10.1 C17.1 NOREF#7.1 NOREF#13.1 OPA227.7 OPA227#2.7 R31.1 R32.2
+15V: ---.1 C1.1 C3.2 C5.1 C12.1 MPY634.16 MPY634#2.16 NOREF#3.2 NOREF#11.1 R1.1 R3.1 R17.1 R31.2
-5V: C11.1 C18.1 NOREF#5.1 NOREF#9.1 NOREF#10.1 OPA227.4 OPA227#2.4 R33.1 R34.2
-15V: ---.3 C2.2 C4.1 C6.2 C13.2 LED2.2 MPY634.10 MPY634#2.10 NOREF#8.1 NOREF#14.1 NOREF#15.1 R3.3 R10.1 R17.3 R24.1 R34.1
GND: ---.2 C1.2 C2.1 C3.1 C4.2 C5.2 C6.1 C7.1 C9.1 C10.2 C11.2 C12.2 C13.1 C14.1 C16.1 C17.2 C18.2 INPUT_X1.1 INPUT_X1.2 INPUT_X1.3 INPUT_X1.4 INPUT_X2.1 INPUT_X2.2 INPUT_X2.3 INPUT_X2.4 INPUT_Y1.1 INPUT_Y1.2 INPUT_Y1.3 INPUT_Y1.4 INPUT_Y2.1 INPUT_Y2.2 INPUT_Y2.3 INPUT_Y2.4 INPUT_Z1.1 INPUT_Z1.2 INPUT_Z1.3 INPUT_Z1.4 INPUT_Z2.1 INPUT_Z2.2 INPUT_Z2.3 INPUT_Z2.4 LED1.2 NOREF#2.1 NOREF#17.1 OUTPUT1.1 OUTPUT1.2 OUTPUT1.3 OUTPUT1.4 OUTPUT2.1 OUTPUT2.2 OUTPUT2.3 OUTPUT2.4 OUTPUT3.1 OUTPUT3.2 OUTPUT3.3 OUTPUT3.4 OUTPUT4.1 OUTPUT4.2 OUTPUT4.3 OUTPUT4.4 R2.1 R5.1 R8.1 R13.2 R19.1 R22.1 R27.2 R32.1 R33.2
OUTPUT1: OUTPUT1.5 R11.2 R14.1
OUTPUT3: NOREF#6.2 NOREF#16.1 OUTPUT3.5 R25.2 R28.1
SF1: ISO1.1 R9.1
SF2: ISO6.1 R23.1
$1N691: LED2.1 R2.2
$1N692: LED1.1 R1.2
$1N1026: ISO2.2 MPY634#2.1 R6.2
$1N1030: INPUT_X1.5 R6.1
$1N1329: R3.2 R4.2
$1N1334: MPY634#2.2 R4.1 R5.2
$1N1483: ISO1.2 MPY634#2.4
$1N1619: INPUT_Y1.5 R7.1
$1N1677: ISO3.2 MPY634#2.7 R8.2
$1N1823: R9.2 R10.2 R10.3
$1N2051: ISO3.1 ISO5.2 MPY634#2.14 R11.1
$1N2262: ISO5.1 MPY634#2.13 R12.2
$1N2332: INPUT_Z1.5 NOREF#4.1 NOREF#12.1 R12.1
$1N2438: ISO4.1 MPY634#2.12 NOREF.1 NOREF#18.1 R13.1
$1N2444: ISO2.1 ISO4.2 MPY634#2.6 R7.2
$1N3638: ISO7.2 MPY634.1 R20.2
$1N3642: INPUT_X2.5 R20.1
$1N3650: R17.2 R18.2
$1N3653: MPY634.2 R18.1 R19.2
$1N3678: ISO6.2 MPY634.4
$1N3683: INPUT_Y2.5 R21.1
$1N3687: ISO8.2 MPY634.7 R22.2
$1N3702: R23.2 R24.2 R24.3
$1N3716: ISO8.1 ISO10.2 MPY634.14 R25.1
$1N3751: ISO10.1 MPY634.13 R26.2
$1N3758: INPUT_Z2.5 R26.1
$1N3761: ISO9.1 MPY634.12 R27.1
$1N3766: ISO7.1 ISO9.2 MPY634.6 R21.2
$1N4258: C7.2 R14.2 R15.2
$1N4259: C8.1 R15.1 R16.2
$1N4260: C9.2 OPA227#2.3 R16.1
$1N4690: C14.2 R28.2 R29.2
$1N4691: C15.1 R29.1 R30.2
$1N4692: C16.2 OPA227.3 R30.1
$1N5354: C8.2 OPA227#2.2 OPA227#2.6 R35.2
$1N5450: OUTPUT2.5 R35.1
$1N5516: C15.2 OPA227.2 OPA227.6 R36.2
$1N5538: OUTPUT4.5 R36.1

Pads without a net: MPY634 3 5 8 9 11 15; MPY634#2 3 5 8 9 11 15; OPA227 1 5 8; OPA227#2 1 5 8

## Routing (per net, layer and track width the routed paths; a pad name or vN(x,y) marks a point on that pad's centre or on a via; arc(x,y) is an arc through that point)
+5V: length 40.1
  Top Layer w0.5: OPA227.7 54.75,21.34 C17.1
  Top Layer w0.6: C10.1 54.5,40.77 OPA227#2.7 NOREF#7.1 ; NOREF#13.1 52.5,21.39 OPA227.7
  Top Layer w0.8: R32.2 R31.1 53.07,43.72 C10.1
  Bottom Layer w0.6: NOREF#7.1 NOREF#13.1
+15V: length 83.6
  Top Layer w0.5: MPY634#2.16 33.29,44.45 C5.1
  Top Layer w0.6: R17.1 29.97,21.51 MPY634.16 33.16,21.21 C12.1 ; NOREF#11.1 28.32,44.45 MPY634#2.16 29.97,44.76 R3.1
  Top Layer w0.8: R3.1 28.18,51.32 28.18,58.05 ; NOREF#3.2 51.07,50.78 R31.2 ; R1.1 C3.2 C1.1 28.18,58.05 ; ---.1 28.18,58.05
  Bottom Layer w0.8: NOREF#3.2 32.51,52.07 R3.1 ; R17.1 29.97,41.53 NOREF#11.1
-5V: length 45.9
  Top Layer w0.6: C11.1 46.12,37.33 OPA227#2.4 49.13,38.23 NOREF#9.1 ; C18.1 46.12,17.9 OPA227.4 48.77,18.8 NOREF#5.1 ; R33.1 R34.2
  Top Layer w0.8: NOREF#10.1 46.61,43.56 45.47,44.7 45.47,49.77 R33.1
  Bottom Layer w0.8: NOREF#10.1 49.15,43.05 NOREF#9.1 NOREF#5.1
-15V: length 130.5
  Top Layer w0.5: MPY634.10 32.65,13.59 C13.2 ; 30.28,36.83 32.53,36.83 C6.2
  Top Layer w0.6: NOREF#8.1 28.07,13.59 MPY634.10 ; NOREF#14.1 30.28,36.83
  Top Layer w0.8: NOREF#15.1 49.26,48.12 R34.1 ; 21.84,52.58 17.14,52.58 R10.1 ; 21.84,52.58 R3.3 ; 21.84,52.58 ---.3 20.59,58.05 C2.2 ; LED2.2 16.26,56.86 C2.2 ; C2.2 C4.1
  Bottom Layer w0.8: NOREF#8.1 24.89,16.51 R17.3 ; 24.89,40 R17.3 ; 24.89,40 R3.3 27.3,47.12 NOREF#15.1 ; 24.89,40 NOREF#14.1 ; R17.3 14.99,26.16 R24.1
GND: length 15.2
  Top Layer w0.8: R2.1 NOREF#17.1 ; R5.1 18.02,50.67 NOREF#2.1
  Bottom Layer w0.8: 17.27,50.67 12.45,50.67 9.91,53.21 NOREF#17.1
OUTPUT1: length 24.8
  Top Layer w0.5: R11.2 36.58,42.42 37.59,41.4 39.73,41.4 R14.1 39.75,51.18 44.45,55.88 OUTPUT1.5
OUTPUT3: length 56.7
  Top Layer w0.254: R25.2 36.07,19.56 38.35,21.84 39.51,21.84 R28.1
  Top Layer w0.6: NOREF#6.2 56.01,58.42 OUTPUT3.5 ; NOREF#16.1 43.82,29.08 39.75,25.02 R28.1
  Bottom Layer w0.6: NOREF#16.1 NOREF#6.2
SF1: length 2.4
  Top Layer w0.254: R9.1 17.71,41.71 ISO1.1
SF2: length 2.4
  Top Layer w0.254: ISO6.1 17.71,17.45 R23.1
$1N691: length 1.9
  Top Layer w0.254: R2.2 14.25,53.36 LED2.1
$1N692: length 1.9
  Top Layer w0.254: LED1.1 36.09,53.25 R1.2
$1N1026: length 6.5
  Top Layer w0.254: MPY634#2.1 20.45,44.12 ISO2.2 17.27,44.88 R6.2
$1N1030: length 16.8
  Top Layer w0.5: R6.1 17.01,48.89 14.61,46.48 10.41,46.48 5.97,50.93 INPUT_X1.5
$1N1329: length 7.2
  Top Layer w0.254: R4.2 21.46,49.39 21.48,49.39 22.61,48.26 26.29,48.26 27.43,49.4 R3.2
$1N1334: length 8.3
  Top Layer w0.254: R5.2 R4.1 22.61,46.24 22.61,44.07 21.72,43.18 MPY634#2.2
$1N1483: length 2.8
  Top Layer w0.254: ISO1.2 20.58,40.84 MPY634#2.4
$1N1619: length 13.1
  Top Layer w0.5: INPUT_Y1.5 16.27,38.1 R7.1
$1N1677: length 4.7
  Top Layer w0.254: ISO3.2 18.03,36.31 R8.2 20.4,36.45 20.78,36.83
$1N1823: length 7.1
  Top Layer w0.254: R10.2 R10.3 13.83,41.16 R9.2
$1N2051: length 23.9
  Top Layer w0.254: ISO3.1 19.12,32.89 25.15,32.89 26.29,34.04 26.29,38.73 29.46,41.91 MPY634#2.14 31.11,41.91 31.62,42.42 R11.1 33.71,41.74 33.71,40.89
$1N2262: length 4.3
  Top Layer w0.254: MPY634#2.13 30.53,40.89 ISO5.1 33.03,40.71 R12.2
$1N2332: length 41
  Top Layer w0.6: NOREF#4.1 44.45,7.24 INPUT_Z1.5 ; R12.1 36.2,39.37 37.72,37.85 NOREF#12.1
  Bottom Layer w0.6: NOREF#12.1 37.72,13.97 NOREF#4.1
$1N2438: length 18.9
  Top Layer w0.254: NOREF#18.1 25.91,39.37 25.91,35.56 24.38,34.04 ISO4.1 ; NOREF.1 MPY634#2.12 30.86,39.37 32.39,37.85 R13.1
  Bottom Layer w0.254: NOREF#18.1 28.32,39.5 NOREF.1
$1N2444: length 20.5
  Top Layer w0.254: R7.2 20.65,37.97 MPY634#2.6 21.84,38.1 22.61,38.86 ; 22.61,38.86 22.61,42.04 22.1,42.54 19.18,42.54 18.47,43.25 ISO2.1 ; 22.61,38.86 22.61,35.56 21.84,34.8 20.07,34.8 19.51,34.24 ISO4.2
$1N3638: length 7.4
  Top Layer w0.254: 19.18,21.21 17.27,23.11 R20.2 ; 19.18,21.21 18.03,20.07 ISO7.2 ; 19.18,21.21 MPY634.1
$1N3642: length 14.3
  Top Layer w0.5: R20.1 16.52,24.89 INPUT_X2.5
$1N3650: length 7
  Top Layer w0.254: R18.2 22.37,27.3 26.16,27.3 27.3,26.16 R17.2
$1N3653: length 8.7
  Top Layer w0.254: MPY634.2 22.23,19.94 22.73,20.45 22.73,22.88 R18.1 R19.2
$1N3678: length 3.1
  Top Layer w0.254: MPY634.4 19.43,17.4 18.62,16.58 ISO6.2
$1N3683: length 14
  Top Layer w0.6: R21.1 14.61,13.46 12.32,11.18 INPUT_Y2.5
$1N3687: length 5.1
  Top Layer w0.254: MPY634.7 19.68,13.59 R22.2 17.9,10.48 ISO8.2
$1N3702: length 7.1
  Top Layer w0.254: R23.2 14.75,18.41 R24.3 R24.2
$1N3716: length 19.8
  Top Layer w0.254: MPY634.14 32.14,18.67 R25.1 33.71,18.88 33.71,18.03 ; ISO8.1 18.23,9.47 19.94,11.18 21.59,11.18 29.08,18.67
$1N3751: length 4.4
  Top Layer w0.254: R26.2 33.03,17.85 ISO10.1 30.91,18.03 MPY634.13
$1N3758: length 29
  Top Layer w0.6: INPUT_Z2.5 56.13,6.6 53.47,9.27 44.7,9.27 37.46,16.51 R26.1
$1N3761: length 15.9
  Top Layer w0.254: ISO9.1 22.35,9.52 28.96,16.13 MPY634.12 31.11,16.13 32.39,14.86 R27.1
$1N3766: length 21.6
  Top Layer w0.254: ISO7.1 18.87,18.74 19.43,19.3 22.23,19.3 22.61,18.92 22.61,15.75 21.72,14.86 MPY634.6 19.3,14.86 R21.2 17.09,12.66 17.09,9.07 17.65,8.51 18.49,8.51 ISO9.2
$1N4258: length 4
  Top Layer w0.254: R14.2 R15.2 C7.2
$1N4259: length 4
  Top Layer w0.254: R16.2 R15.1 41.8,41.4 C8.1
$1N4260: length 5.2
  Top Layer w0.254: C9.2 R16.1 46.9,39.39 OPA227#2.3
$1N4690: length 4.1
  Top Layer w0.254: R28.2 R29.2 C14.2
$1N4691: length 4
  Top Layer w0.254: R30.2 R29.1 41.8,22.1 C15.1
$1N4692: length 5.3
  Top Layer w0.254: OPA227.3 47,20.08 R30.1 C16.2
$1N5354: length 12.8
  Top Layer w0.254: C8.2 44.07,43.31 46.61,40.77 OPA227#2.2 49.02,40.77 50.29,39.5 OPA227#2.6 54.87,39.5 R35.2
$1N5450: length 7.7
  Top Layer w0.6: OUTPUT2.5 60.2,41.66 58.17,39.62 R35.1
$1N5516: length 13.4
  Top Layer w0.254: R36.2 54.87,20.07 OPA227.6 49.91,20.07 48.64,21.34 OPA227.2 45.97,21.34 45.47,21.84 45.47,22.73 44.2,24 C15.2
$1N5538: length 8
  Top Layer w0.6: R36.1 57.91,19.94 60.71,22.73 OUTPUT4.5

## Copper pours and planes (outline as drawn; the poured copper is in the pictures)
+5V on Top Layer: 52.32,51.18 55.63,51.18 55.63,43.05 52.32,43.05
+15V on Top Layer: 25.91,60.2 37.27,60.2 37.27,48.64 25.91,48.64
+15V on Bottom Layer: 26.8,44.96 31.11,44.96 31.11,25.27 26.8,25.27
+15V on Bottom Layer: 28.96,53.09 51.07,53.09 51.07,48.89 28.96,48.89
-5V on Top Layer: 44.45,51.05 49.78,51.05 49.78,42.78 44.45,42.78
-15V on Top Layer: 11.53,60.32 25.67,60.32 25.67,48.76 11.53,48.76
-15V on Bottom Layer: 25.15,48.39 49.66,48.39 49.66,46.1 25.15,46.1
-15V on Bottom Layer: 23.34,51.08 29.34,51.08 29.34,12.06 23.34,12.06
GND on Top Layer: -6.73,70.48 72.77,70.48 72.77,-11.68 -6.73,-11.68
GND on Bottom Layer: -2.54,66.17 69.21,66.17 69.21,-3.94 -2.54,-3.94
$1N2444 on Top Layer: 22.21,42.54 23.23,42.54 23.23,34.78 22.21,34.78

## Text on the board
Top Silkscreen Layer: +++ | 2025TI_相关器
